# Altium schematic sheet CPUPower.SchDoc
size 393 x 279 mm; DrawnBy: Gustav Eckerbom; SheetNumber: 3; SheetTotal: 6; Project revision: Rev 1; Sheet name: CPU Power; Sheet size: A3; Project: alife7-genx320cam
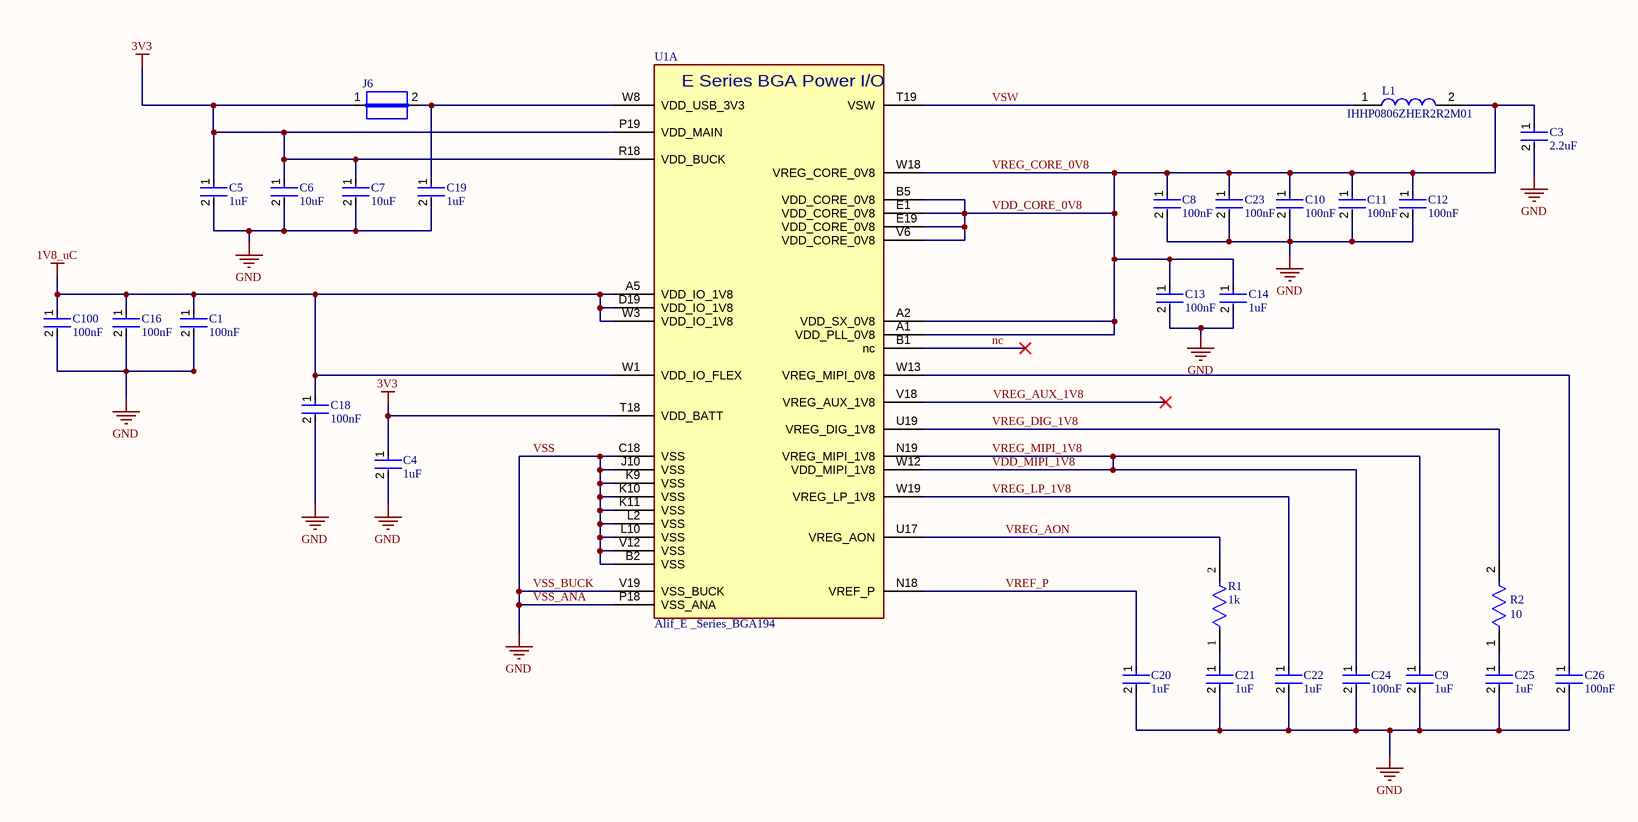
[diagram p0: CPUPower.SchDoc]

## Parts
C1  100nF  [FP-C0603X104K3RACTU-MFG]
C3  2.2uF  [FP-CC0603-DA-MFG]
C4  1uF  [FP-CL10-IPC_C]
C5  1uF  [FP-CL10-IPC_C]
C6  10uF  [FP-CC0603-0_15-0_95-IPC_C]
C7  10uF  [FP-CC0603-0_15-0_95-IPC_C]
C8  100nF  [FP-C0603X104K3RACTU-MFG]
C9  1uF  [FP-CL10-IPC_C]
C10  100nF  [FP-C0603X104K3RACTU-MFG]
C11  100nF  [FP-C0603X104K3RACTU-MFG]
C12  100nF  [FP-C0603X104K3RACTU-MFG]
C13  100nF  [FP-C0603X104K3RACTU-MFG]
C14  1uF  [FP-CL10-IPC_C]
C16  100nF  [FP-C0603X104K3RACTU-MFG]
C18  100nF  [FP-C0603X104K3RACTU-MFG]
C19  1uF  [FP-CL10-IPC_C]
C20  1uF  [FP-CL10-IPC_C]
C21  1uF  [FP-CL10-IPC_C]
C22  1uF  [FP-CL10-IPC_C]
C23  100nF  [FP-C0603X104K3RACTU-MFG]
C24  100nF  [FP-C0603X104K3RACTU-MFG]
C25  1uF  [FP-CL10-IPC_C]
C26  100nF  [FP-C0603X104K3RACTU-MFG]
C100  100nF  [FP-C0603X104K3RACTU-MFG]
J6  JUMPER  [JUMPER]  (value not drawn)
L1  IHHP0806ZHER2R2M01  [INDC2016X80N]
R1  1k  [FP-RCA0603-e3-MFG]
R2  10  [FP-RT0603-MFG]
U1  Alif_E _Series_BGA194  [BGA194 _CENTERED]  (part A of 4)

## Nets
1V8_uC: C1.1 C16.1 C18.1 C100.1 U1.A5(VDD_IO_1V8) U1.D19(VDD_IO_1V8) U1.W1(VDD_IO_FLEX) U1.W3(VDD_IO_1V8)
3V3: C4.1 C5.1 C6.1 C7.1 J6.1 U1.P19(VDD_MAIN) U1.R18(VDD_BUCK) U1.T18(VDD_BATT)
VSS: C1.2 C3.2 C4.2 C5.2 C6.2 C7.2 C8.2 C9.2 C10.2 C11.2 C12.2 C13.2 C14.2 C16.2 C18.2 C19.2 C20.2 C21.2 C22.2 C23.2 C24.2 C25.2 C26.2 C100.2 U1.B2(VSS) U1.C18(VSS) U1.J10(VSS) U1.K9(VSS) U1.K10(VSS) U1.K11(VSS) U1.L2(VSS) U1.L10(VSS) U1.P18(VSS_ANA) U1.V12(VSS) U1.V19(VSS_BUCK)  [also labelled GND, VSS_ANA, VSS_BUCK]
nc: U1.B1(nc)
VDD_CORE_0V8: C3.1 C8.1 C10.1 C11.1 C12.1 C13.1 C14.1 C23.1 L1.2 U1.A1(VDD_PLL_0V8) U1.A2(VDD_SX_0V8) U1.B5(VDD_CORE_0V8) U1.E1(VDD_CORE_0V8) U1.E19(VDD_CORE_0V8) U1.V6(VDD_CORE_0V8) U1.W18(VREG_CORE_0V8)  [also labelled VREG_CORE_0V8]
VDD_MIPI_1V8: C9.1 C24.1 U1.N19(VREG_MIPI_1V8) U1.W12(VDD_MIPI_1V8)  [also labelled VREG_MIPI_1V8]
VREF_P: C20.1 U1.N18(VREF_P)
VREG_AON: R1.2 U1.U17(VREG_AON)
VREG_AUX_1V8: U1.V18(VREG_AUX_1V8)
VREG_DIG_1V8: R2.2 U1.U19(VREG_DIG_1V8)
VREG_LP_1V8: C22.1 U1.W19(VREG_LP_1V8)
VSW: L1.1 U1.T19(VSW)
NetC19_1: C19.1 J6.2 U1.W8(VDD_USB_3V3)
NetC21_1: C21.1 R1.1
NetC25_1: C25.1 R2.1
NetC26_1: C26.1 U1.W13(VREG_MIPI_0V8)

## Notes on the sheet
- Project:
- Sheet Name
- Project revision:
- Drawn by:
- Sheet size
- SHEET
- OF
- (in symbol E7_B0_194BGA, part A) E Series BGA Power I/O

## Library data of the parts
C1 C8 C10-C13 C16 C18 C23 C24 C26 C100 = CMP-2006-00002-2: CAP CER 0.1UF 25V X7R 0603; Dielectric Material: Ceramic; Tolerance: 10%; Dissipation Factor: 3.5%; Features: Soft Termination; Construction: Flat; Number of Pins: 2; Depth: 0.8mm; Case Code (Metric): 1608; Termination: SMD/SMT; REACH SVHC: No SVHC; Dielectric: X7R; Thickness: 0.034inch; Series: C0603X; Case Code (Imperial): 0603; Voltage: 25V; Radiation Hardening: No; Length: 1.6mm; RoHS Compliant: Yes; Case/Package: 0603; Voltage Rating (DC): 25V; Max Operating Temperature: 125°C; Package Quantity: 1; Packaging: Tape and Reel; Width: 0.8mm; Height: 0.8mm; Capacitance: 100nF; Mount: Surface Mount; Voltage Rating: 25V; Contact Plating: Tin; Min Operating Temperature: -55°C
C3 = CMP-03422-000262-1: CAP CER 2.2UF 6.3V X5R 0603; Manufacturer: YAGEO; Manufacturer Part Number: CC0603KRX5R5BB225; Tolerance: 0.1; Temperature Coefficient: 15%; Material: Ceramic; Automotive: No; Temperature: -55°C to +125°C; Device Class L3: Ceramic Capacitors; Voltage Rating: 6.3 V; Device Class L1: Passive Components; Height: 0.9mm; Device Class L2: Capacitors; Temperature Range High: +125°C; Temperature Range Low: -55°C; Footprint Url: http://www.yageo.com/exep/pages/download/literatures/UPY-C_GEN_24.pdf; RoHS: TRUE; Voltage: 6.3 V; Digikey Description: CAP CER 2.2UF 6.3V X5R 0603; Package: CC0603-DA; ComponentLink2Description: Datasheet; Category: Cap; Temperature Characteristic: X5R; Capacitance: 2.2 uF; Value: 2.2 uF; Lead Free: Yes; ComponentLink2URL: http://www.yageo.com/documents/recent/UPY-GPHC_X7R_6.3V-to-50V_18.pdf; Octopart: https://octopart.com/cc0603krx5r5bb225-yageo-42244630; Mouser Description: Multilayer Ceramic Capacitors MLCC - SMD/SMT 2.2uF 6.3V X5R 10%
C4 C5 C9 C14 C19-C22 C25 = CMP-001-00087-5: Ceramic Capacitor, Multilayer, Ceramic, 10V, 10% +Tol, 10% -Tol, X5R, 15% TC, 1uF, Surface Mount, 0603; Value: 1µF; Min Operating Temperature: -55°C; Max Operating Temperature: 85°C; Case/Package: 0603; Capacitor Type: Ceramic; Mounting Technology: Surface Mount; Pins: 2; RoHS Compliant: Yes
C6 C7 = CMP-001-00088-4: Ceramic Capacitor, Multilayer, Ceramic, 6.3V, 10% +Tol, 10% -Tol, X5R, 15% TC, 10uF, Surface Mount, 0603; Value: 10µF; Min Operating Temperature: -55°C; Max Operating Temperature: 85°C; Case/Package: 0603; RoHS Compliant: Yes; Capacitor Type: Ceramic; Mounting Technology: Surface Mount; Pins: 2
J6 = CMP-009-00061-2: Pins: 2
L1 = IHHP0806ZHER2R2M01: Inductor; Manufacturer_Name: Vishay; Datasheet Link: https://www.vishay.com/docs/34591/ihhp-0806zh-01.pdf; Height: 0.8mm; Manufacturer_Part_Number: IHHP0806ZHER2R2M01; Mouser Part Number: 70-IHHP0806ZHR2R2M01; Mouser Price/Stock: https://www.mouser.co.uk/ProductDetail/Vishay-Dale/IHHP0806ZHER2R2M01?qs=tlsG%2FOw5FFirx3sf52FHuA%3D%3D
R1 = CMP-00030-22249381-1: RCA06031K00FKEA SMD Chip Resistor, 1 kOhm, ± 1%, 100 mW, 0603 [1608 Metric], Thick Film, Anti-Sulfur; Max Power Dissipation: 100mW; Temperature Coefficient: 100ppm/°C; Voltage Rating (DC): 75V; Resistance: 1kΩ; Number of Terminations: 2; Packaging: Cut Tape; Features: Anti-Sulfur, Automotive AEC-Q200; RoHS: Compliant; Power Rating: 100mW; Composition: Thick Film; Radiation Hardening: No; Voltage Rating: 75V; REACH SVHC: No SVHC; Schedule B: 8533210045; Depth: 850µm; Military Standard: Not; Case Code (Metric): 1608; Contact Plating: Tin; Tolerance: 1%; NexarPartId: 22249381; Max Operating Temperature: 155°C; Mount: Surface Mount; Length: 1.55mm; Case Code (Imperial): 0603; Width: 838.2µm; Min Operating Temperature: -55°C; Case/Package: 0603; Height: 508µm
R2 = CMP-03412-033408-1: RES SMD 10 OHM 1% 1/10W 0603; Manufacturer Part Number: RT0603FRE0710RL; Manufacturer: Yageo; Voltage Rating: 75V; Power Rating: 0.1W; Temperature Coefficient: 50 ppm/°C; Resistance: 10Ω; Tolerance: 0.01; Value: 10Ω; Footprint Url: http://www.yageo.com/exep/pages/download/literatures/PYu-R_Mount_10.pdf; Ipc Land Pattern Name: RESC16080X45; RoHS: TRUE; Device Class L2: Resistors; Device Class L3: Chip SMD Resistors; Category: Res; Device Class L1: Passive Components; ComponentLink2URL: http://www.yageo.com/documents/recent/PYu-RT_1-to-0.01_RoHS_L_9.pdf; Temperature Range Low: -55°C; Height: 0.55mm; Digikey Description: RES SMD 10 OHM 1% 1/10W 0603; Temperature Range High: +155°C; Lead Free: Yes; Composition: Thin Film; Mouser Description: Thin Film Resistors - SMD 1/10W 10 ohm 1% 50ppm; Automotive: No; Package: RT0603; Temperature: -55°C to +155°C; Series: RT; ComponentLink2Description: Datasheet; Octopart: https://octopart.com/rt0603fre0710rl-yageo-39827693
U1 = E7_B0_194BGA: IC,Alif E7 MCU, Rev B silicon,BGA194; Manufacturer 1: Alif Semi; Manufacturer Part Number 1: AE722F80F55D5LS